# EAGLE design Arduino_2313_ref_a (EAGLE 6.2)
ATMEL 2313 USB interface uses FT232
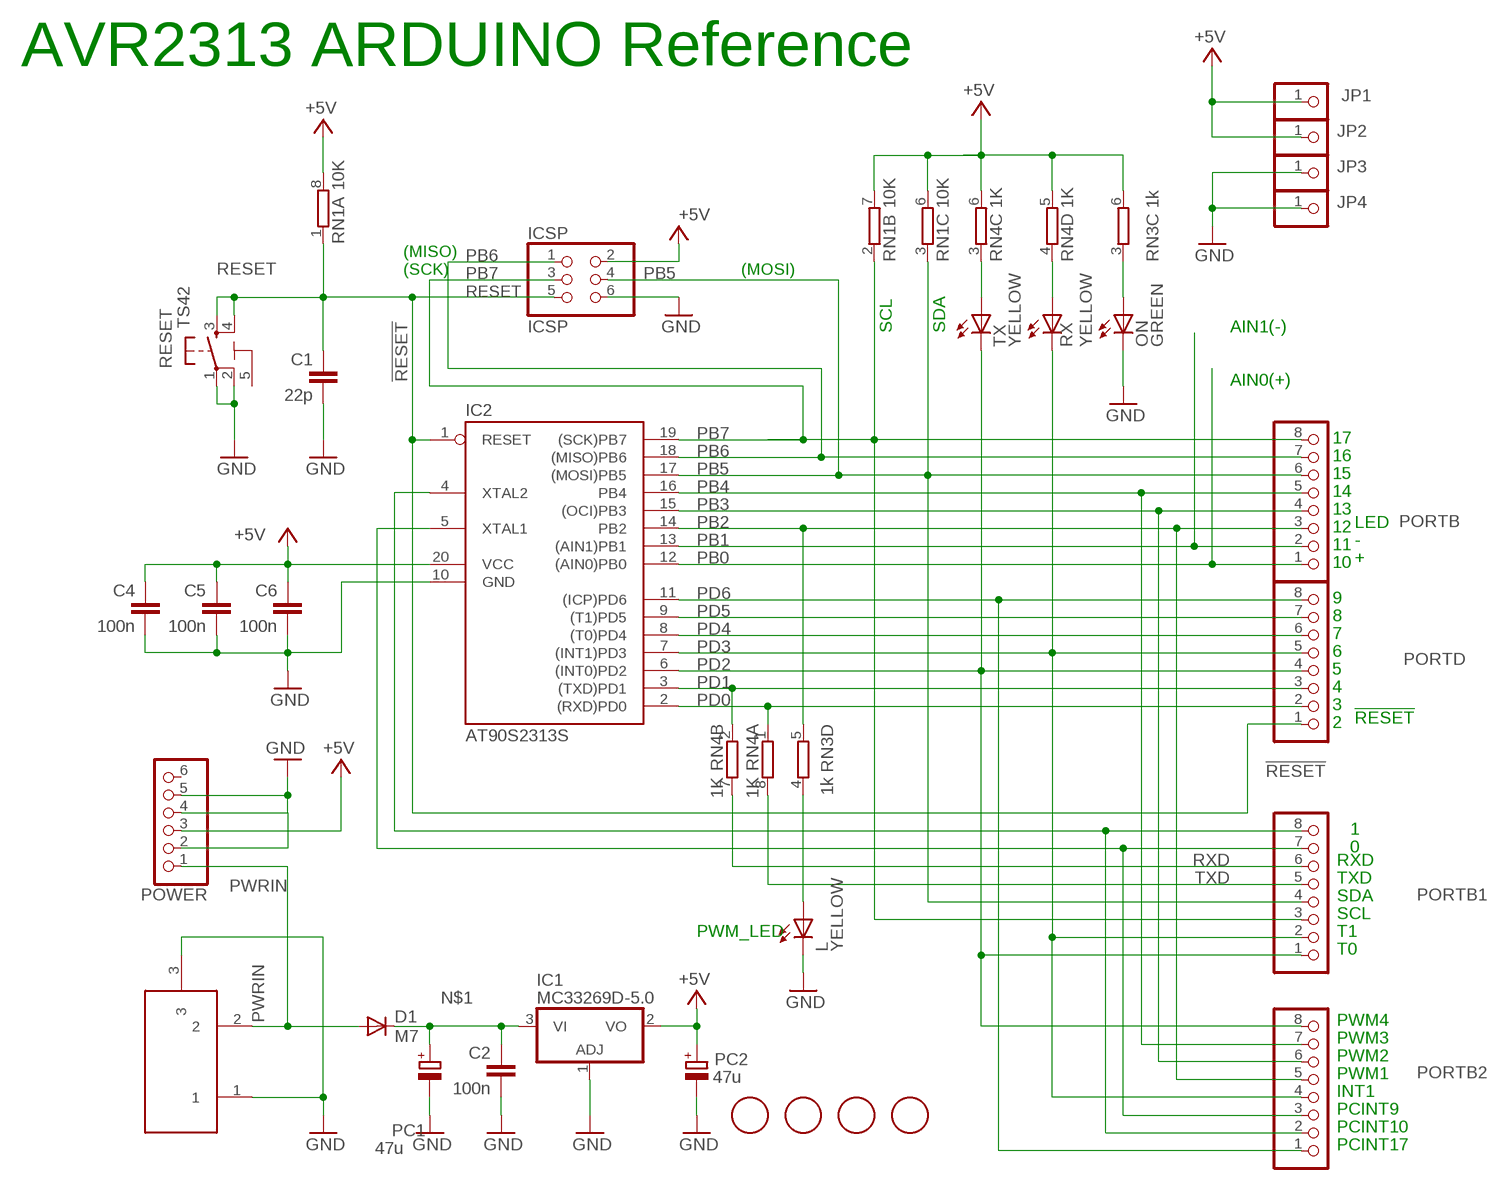
[diagram p0: schematic, sheet 1]

## Parts
C1  22p  C-EU0603-RND  [C0603-ROUND]
C2  100n  C-EU0603-RND  [C0603-ROUND]
C4  100n  C-EU0603-RND  [C0603-ROUND]
C5  100n  C-EU0603-RND  [C0603-ROUND]
C6  100n  C-EU0603-RND  [C0603-ROUND]
D1  M7  DIODE-SMB  [SMB]
IC1  MC33269D-5.0  [DPACK]
IC2  AT90S2313S  [SO20L]
ICSP  ICSP  PINHD-2X3  [2X03]
JP1  PINHD-1X1  [1X01]
JP2  PINHD-1X1  [1X01]
JP3  PINHD-1X1  [1X01]
JP4  PINHD-1X1  [1X01]
L  YELLOW  LEDCHIP-LED0805  [CHIP-LED0805]
ON  GREEN  LEDCHIP-LED0805  [CHIP-LED0805]
PC1  47u  CPOL-EUD  [PANASONIC_D]
PC2  47u  CPOL-EUD  [PANASONIC_D]
PORTB  PINHD-1X8  [1X08]
PORTB1  PINHD-1X8  [1X08]
PORTB2  PINHD-1X8  [1X08]
PORTD  PINHD-1X8  [1X08]
POWER  PINHD-1X6  [1X06]
RESET  TS42  [TS42]
RN1  10K  4R-NCAT16  [CAT16]
RN3  1k  4R-NCAY16  [CAY16]
RN4  1K  4R-NCAY16  [CAY16]
RX  YELLOW  LEDCHIP-LED0805  [CHIP-LED0805]
TX  YELLOW  LEDCHIP-LED0805  [CHIP-LED0805]
U$2  FIDUCIALMOUNT  [FIDUCIA-MOUNT]
U$3  FIDUCIALMOUNT  [FIDUCIA-MOUNT]
U$4  FIDUCIALMOUNT  [FIDUCIA-MOUNT]
U$5  FIDUCIALMOUNT  [FIDUCIA-MOUNT]
X1  DC21MMX  [DC-21MM]

## Nets
!RESET: IC2.1(RESET) ICSP.5 PORTD.1
+5V: C4.1 C5.1 C6.1 IC1.2(VO) IC2.20(VCC) ICSP.2 JP1.1 JP2.1 PC2.+ POWER.3 RN1.6 RN1.7 RN1.8 RN3.6 RN4.5 RN4.6
GND: C1.2 C2.2 C4.2 C5.2 C6.2 IC1.1(ADJ) IC2.10(GND) ICSP.6 JP3.1 JP4.1 L.C ON.C PC1.- PC2.- POWER.2 POWER.4 POWER.5 RESET.1 RESET.2 X1.1 X1.3
N$1: C2.1 D1.C IC1.3(VI) PC1.+
N$2: L.A RN3.4
N$3: ON.A RN3.3
N$54: RN4.4 RX.A
N$55: RN4.3 TX.A
PA0: IC2.5(XTAL1) PORTB1.7 PORTB2.3
PA1: IC2.4(XTAL2) PORTB1.8 PORTB2.2
PB0: IC2.12((AIN0)PB0) PORTB.1
PB1: IC2.13((AIN1)PB1) PORTB.2
PB2: IC2.14(PB2) PORTB2.5 PORTB.3 RN3.5
PB3: IC2.15((OCI)PB3) PORTB2.6 PORTB.4
PB4: IC2.16(PB4) PORTB2.7 PORTB.5
PB5: IC2.17((MOSI)PB5) ICSP.4 PORTB1.4 PORTB.6 RN1.3
PB6: IC2.18((MISO)PB6) ICSP.1 PORTB.7
PB7: IC2.19((SCK)PB7) ICSP.3 PORTB1.3 PORTB.8 RN1.2
PD0: IC2.2((RXD)PD0) PORTD.2 RN4.1
PD1: IC2.3((TXD)PD1) PORTD.3 RN4.2
PD2: IC2.6((INT0)PD2) PORTB1.1 PORTB2.8 PORTD.4 TX.C
PD3: IC2.7((INT1)PD3) PORTB1.2 PORTB2.4 PORTD.5 RX.C
PD4: IC2.8((T0)PD4) PORTD.6
PD5: IC2.9((T1)PD5) PORTD.7
PD6: IC2.11((ICP)PD6) PORTB2.1 PORTD.8
PWRIN: D1.A POWER.1 X1.2
RESET: C1.1 RESET.3 RESET.4 RN1.1
RXD: PORTB1.6 RN4.7
TXD: PORTB1.5 RN4.8
Unconnected: POWER.6 RN1.4 RN1.5 RN3.1 RN3.2 RN3.7 RN3.8

## Notes on the sheet
- AVR2313 ARDUINO Reference
- (MISO)
- (SCK) | (MOSI)
- SCL | SDA | AIN1(-)
- AIN0(+)
- 17
- 16
- 15
- 14
- 13
- 12 | LED
- 11 | -
- 10 | +
- 9
- 8
- 7
- 6
- 5
- 4
- 3
- 2 | !RESET
- 1
- 0
- RXD
- TXD
- SDA
- SCL
- PWM_LED | T1
- T0
- PWM4
- PWM3
- PWM2
- PWM1
- INT1
- PCINT9
- PCINT10
- PCINT17

## Power pins joined to a net without a drawn wire
5-GND: RESET.5(5-GND)

## Library data of the parts
C1 C2 C4-C6 = SmartPrj:C-EU: CAPACITOR, European symbol
D1 = diode:DIODE-: DIODE
IC1 = linear:MC33269?*: Adjustable Output Low Dropout Voltage Regulator 800 mA Source: http://www.onsemi.com/pub/Collateral/MC33269-D.PDF
IC2 = atmel:AT90S2313: MICROCONTROLLER 2 Kbytes FLASH 128 bytes SRAM 128 bytes EEPROM UART; OC_FARNELL: unknown; OC_NEWARK: unknown
ICSP = pinhead:PINHD-2X3: PIN HEADER
JP1-JP4 = pinhead:PINHD-1X1: PIN HEADER
L ON RX TX = led:LED: LED OSRAM: - CHIPLED LG R971, LG N971, LY N971, LG Q971, LY Q971, LO R971, LY R971 LH N974, LH R974 LS Q976, LO Q976, LY Q976 LO Q996 - Hyper CHIPLED LW Q18S LB Q993, LB Q99A, LB R99A - SideLED LS A670, LO A670, LY A670, LG A670, LP A670 LB A673, LV A673, LT A673, LW A673 LH A674 LY A675 LS A676, LA A676, LO A676, LY A676, LW A676 LS A679, LY A679, LG A679 - Hyper Micro SIDELED® LS Y876, LA Y876, LO Y876, LY Y876 LT Y87S - SmartLED LW L88C, LW L88S LB L89C, LB L89S, LG L890 LS L89K, LO L89K, LY L89K LS L896, LA L896, LO L896, LY L896 - TOPLED LS T670, LO T670, LY T670, LG T670, LP T670 LSG T670, LSP T670, LSY T670, LOP T670, LYG T670 LG T671, LOG T671, LSG T671 LB T673, LV T673, LT T673, LW T673 LH T674 LS T676, LA T676, LO T676, LY T676, LB T676, LH T676, LSB T676, LW T676 LB T67C, LV T67C, LT T67C, LS T67K, LO T67K, LY T67K, LW E67C LS E67B, LA E67B, LO E67B, LY E67B, LB E67C, LV E67C, LT E67C LW T67C LS T679, LY T679, LG T679 LS T770, LO T770, LY T770, LG T770, LP T770 LB T773, LV T773, LT T773, LW T773 LH T774 LS E675, LA E675, LY E675, LS T675 LS T776, LA T776, LO T776, LY T776, LB T776 LHGB T686 LT T68C, LB T68C - Hyper Mini TOPLED® LB M676 - Mini TOPLED Santana® LG M470 LS M47K, LO M47K, LY M47K Source: http://www.osram.convergy.de LUXEON: - LUMILED® LXK2-PW12-R00, LXK2-PW12-S00, LXK2-PW14-U00, LXK2-PW14-V00 LXK2-PM12-R00, LXK2-PM12-S00, LXK2-PM14-U00 LXK2-PE12-Q00, LXK2-PE12-R00, LXK2-PE12-S00, LXK2-PE14-T00, LXK2-PE14-U00 LXK2-PB12-K00, LXK2-PB12-L00, LXK2-PB12-M00, LXK2-PB14-N00, LXK2-PB14-P00, LXK2-PB14-Q00 LXK2-PR12-L00, LXK2-PR12-M00, LXK2-PR14-Q00, LXK2-PR14-R00 LXK2-PD12-Q00, LXK2-PD12-R00, LXK2-PD12-S00 LXK2-PH12-R00, LXK2-PH12-S00 LXK2-PL12-P00, LXK2-PL12-Q00, LXK2-PL12-R00 Source: www.luxeon.com KINGBRIGHT: KA-3528ASYC Source: www.kingbright.com
PC1 PC2 = rcl:CPOL-EU: POLARIZED CAPACITOR, European symbol
PORTB PORTB1 PORTB2 PORTD = pinhead:PINHD-1X8: PIN HEADER
POWER = pinhead:PINHD-1X6: PIN HEADER
RESET = st-mod v1.4:TS42: TS42 Dongnan Electronics Tact switch VDC 12V - 50mA
RN1 RN3 RN4 = resistor-dil:4R-N: Array Chip Resistor Source: RS Component / Phycomp; OC_FARNELL: unknown; OC_NEWARK: unknown
U$2-U$5 = SmartPrj:FIDUCIALMOUNT
X1 = powersupply:DC21MM

## Net classes
0 default: width 0.152 mm, drill 0.305 mm, clearance 0.152 mm

## Board
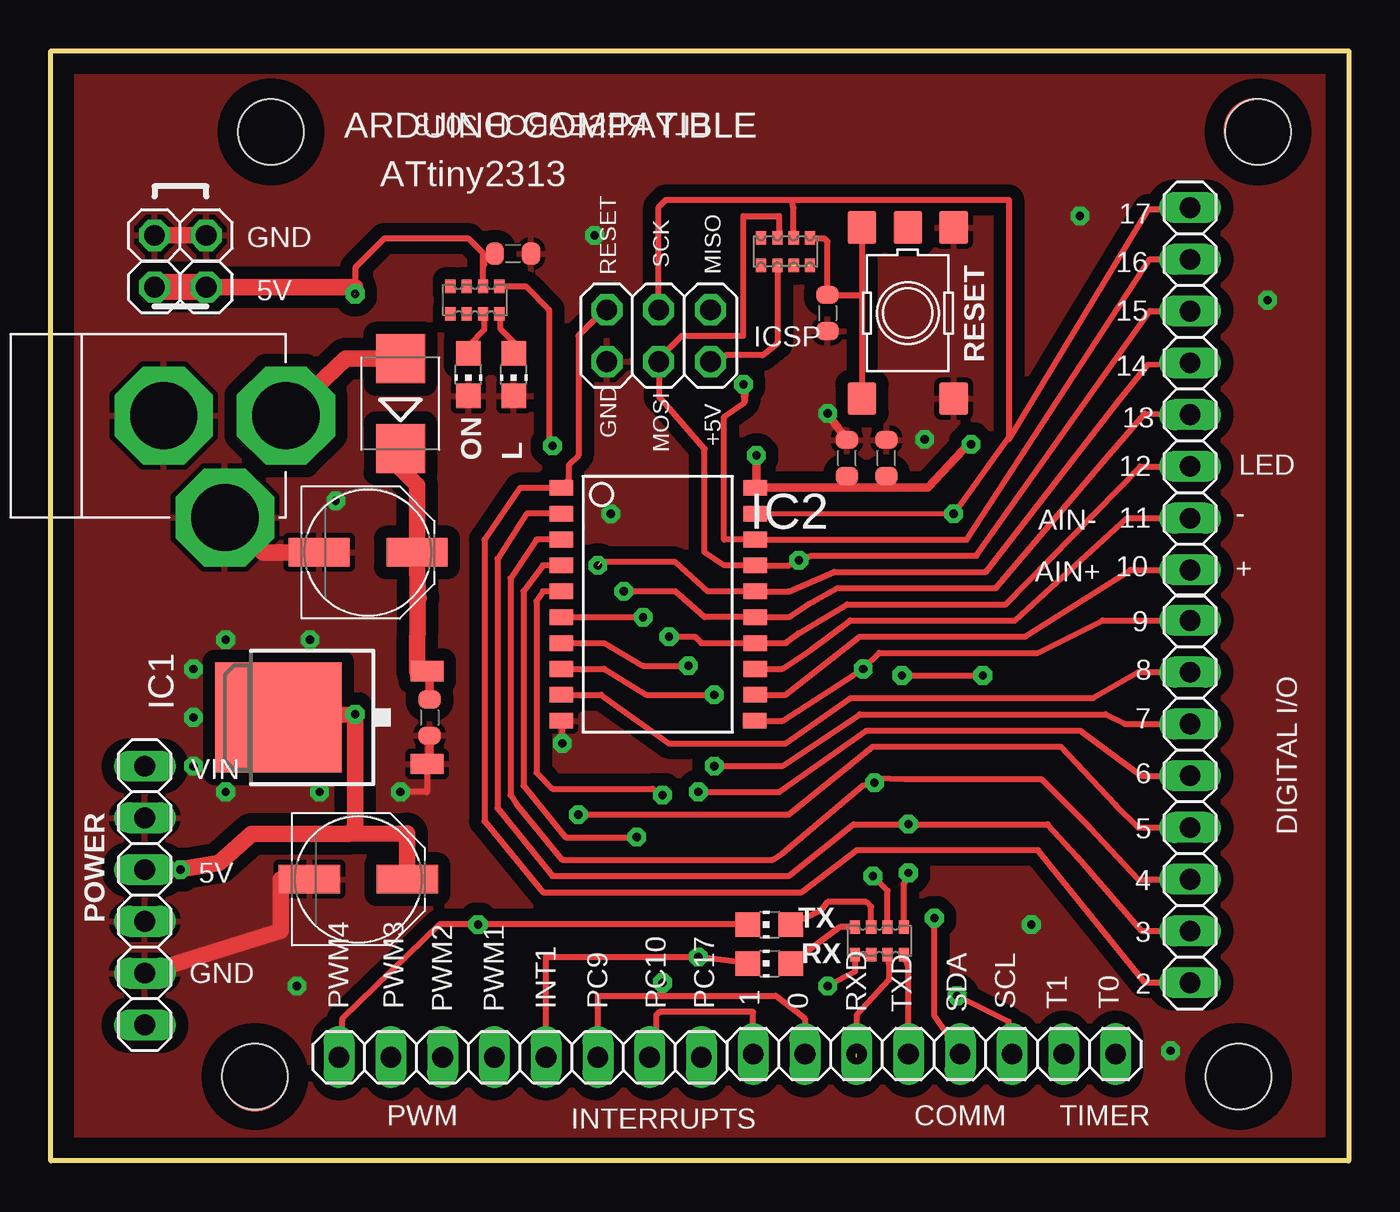
[diagram p1: board, top side]
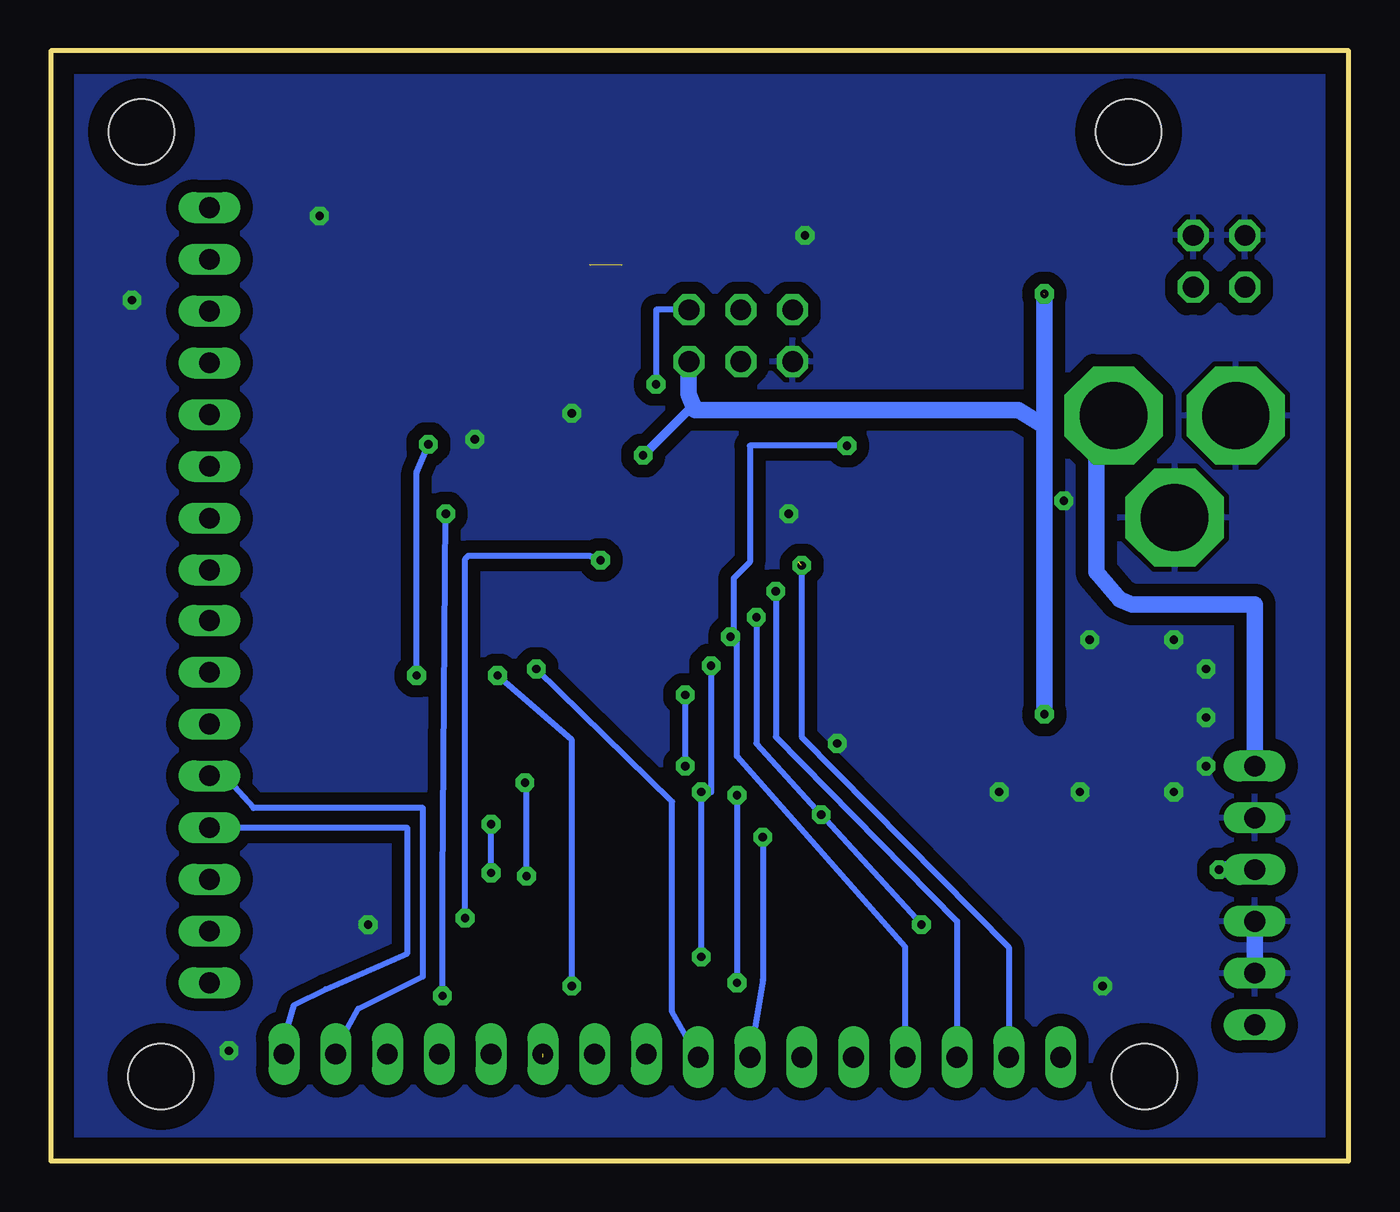
[diagram p2: board, bottom side, seen from below]

Size 63.66 x 54.45 mm. Coordinates in mm from the lower left corner, seen from the top.
Outline: 0,54.45 63.66,54.45 63.66,0 0,0 0,54.45
Copper layers (1*16): Top 0.035mm / dielectric 1.5mm / Bottom 0.035mm
Design rules: minimum track width 6mil, minimum drill 12mil, track to track 6mil, track to pad 6mil, pad to pad 6mil, via to via 6mil, smd to smd 6mil, copper to edge 40mil, drill to drill 12mil, minimum pad ring 10mil, minimum via ring 10mil, stop-mask expansion 2mil, vias tented up to drill 1mil, thermal gap 10mil
Holes 3.2 mm at 58.26,4.13 10.79,50.48 10,4.13 59.21,50.48

### Footprints (pad centres in the part's own frame; a part is rotated, then mirrored left to right if it is on the bottom)
C0603-ROUND = smd 0.898 x 1.1: 1 -0.889,0; 2 0.889,0
SMB = smd 2.4 x 2.4: A 2.2,0; C -2.2,0
DPACK = smd 1 x 1.6: 1 -2.28,-4.8; 3 2.28,-4.8 | smd 5.4 x 6.2: 2 0,2.5
SO20L = smd 0.762 x 1.143: 1 -5.08,-5.131; 2 -3.81,-5.131; 3 -2.54,-5.131; 4 -1.27,-5.131; 5 0,-5.131; 6 1.27,-5.131; 7 2.54,-5.131; 8 3.81,-5.131; 9 5.08,-5.131; 10 6.35,-5.131; 11 6.35,4.369; 12 5.08,4.394; 13 3.81,4.394; 14 2.54,4.394; 15 1.27,4.394; 16 0,4.394; 17 -1.27,4.394; 18 -2.54,4.394; 19 -3.81,4.394; 20 -5.08,4.394
2X03 = drill 1.016 octagon: 1 -2.54,-1.27; 2 -2.54,1.27; 3 0,-1.27; 4 0,1.27; 5 2.54,-1.27; 6 2.54,1.27
1X01 = drill 1.016 octagon: 1 0,0
CHIP-LED0805 = smd 1.2 x 1.2: A 0,-1.05; C 0,1.05
PANASONIC_D = smd 3 x 1.4: + 2.4,0; - -2.4,0
1X08 = drill 1.016 long: 1 -8.89,0; 2 -6.35,0; 3 -3.81,0; 4 -1.27,0; 5 1.27,0; 6 3.81,0; 7 6.35,0; 8 8.89,0
1X06 = drill 1.016 long: 1 -6.35,0; 2 -3.81,0; 3 -1.27,0; 4 1.27,0; 5 3.81,0; 6 6.35,0
TS42 = smd 1.6 x 1.4: 1 -4.2,2.25; 2 4.2,2.25; 3 -4.2,-2.25; 4 4.2,-2.25; 5 -4.2,0
CAT16 = smd 0.5 x 0.65: 1 -1.2,-0.675; 2 -0.4,-0.675; 3 0.4,-0.675; 4 1.2,-0.675; 5 1.2,0.675; 6 0.4,0.675; 7 -0.4,0.675; 8 -1.2,0.675
CAY16 = smd 0.5 x 0.65: 1 -1.2,-0.675; 2 -0.4,-0.675; 3 0.4,-0.675; 4 1.2,-0.675; 5 1.2,0.675; 6 0.4,0.675; 7 -0.4,0.675; 8 -1.2,0.675
FIDUCIA-MOUNT = smd 1.016 x 1.016: P$1 0,0
DC-21MM = drill 3.302 pad 4.826 octagon: 1 -5.08,-3.353; 2 -0.076,-6.35; 3 -0.076,-0.356

### Placement (x,y rotation side)
C1  38.1,41.59 270 top
C2  18.57,21.75 270 top
C4  40.99,34.48 90 top
C5  39.05,34.48 90 top
C6  22.66,44.51 0 top
D1  17.14,37.15 90 top
IC1  13.65,21.75 90 top
IC2  30.16,27.94 270 top
ICSP  29.81,40.48 180 top
JP1  7.62,42.86 180 top
JP2  5.08,42.86 180 top
JP3  7.62,45.4 180 top
JP4  5.08,45.4 180 top
L  22.7,38.58 180 top
ON  20.48,38.58 180 top
PC1  15.56,29.84 0 top
PC2  15.08,13.81 0 top
PORTB  55.88,37.88 90 top
PORTB1  43.34,5.24 180 top
PORTB2  23.02,5.08 180 top
PORTD  55.88,17.62 90 top
POWER  4.6,13.02 270 top
RESET  42.04,41.59 270 top
RN1  36.04,44.61 180 top
RN3  20.8,42.23 0 top
RN4  40.64,10.79 180 top
RX  35.24,9.68 90 top
TX  35.24,11.59 90 top
U$2  59.09,50.57 0 top
U$3  10.83,50.51 270 top
U$4  10,4 270 top
U$5  58.26,4.22 0 top
X1  5.18,36.64 90 top

### Tracks (layer width: path | path; a pad name or v marks a point on that pad's centre or on a via)
!RESET
  Top 0.305: PORTD.1 53.66,8.73 48.42,15.24 39.53,15.24 36.83,13.18 24.13,13.18 21.27,16.67 21.27,30.48 23.02,33.02 IC2.1 25.4,33.39 25.4,34.13 25.88,34.61 25.88,40.48 27.15,41.75 ICSP.5
+5V  (via drill 0.41, 0.41 pad 0.25)  (3 unrouted)
  Top 0.254: RN4.6 RN4.5
  Top 0.305: RN4.5 39.44,9.28 v38.1,8.57 | v41.75,23.81 v45.72,23.81 | v45.14,35.15 44.98,34.95 44.75,34.88 | RN1.6 35.64,40.08 34.93,39.53 33.15,39.53 ICSP.2 | C6.1 21.24,44.13 21.27,43.97 21.2,43.9 RN3.6 21.2,44.53 20.48,45.24 16.35,45.24 14.92,43.81 v14.92,42.55
  Top 0.406: 38.42,33.02 IC2.20 34.61,33.07 v34.61,34.61 | 38.42,33.02 39.05,33.02 | 39.05,33.02 43.02,33.02 44.75,34.88 44.93,35.08 v45.14,35.15 | C4.1 40.83,33.05 38.42,33.02 | C5.1 39.05,33.02
  Top 0.813: PC2.+ 17.48,16.05 14.61,16.05 | 14.61,16.05 9.84,16.03 8.26,14.61 v6.35,14.29 | IC1.2 v14.92,21.91 14.92,16.36 14.61,16.05 | JP1.1 14.92,42.86 v14.92,42.55
  Top 1.27: JP1.1 JP2.1
  Bottom 0.305: 32.39,39.4 ICSP.2 | v38.1,8.57 38.1,20.64 v41.75,23.81 | v45.72,23.81 45.72,33.78 v45.14,35.15
  Bottom 0.406: 32.07,36.83 32.39,36.83 v34.61,34.61
  Bottom 0.813: v14.92,21.91 14.92,36.04 | 14.92,36.04 16.19,36.83 32.07,36.83 32.39,37.62 32.39,39.18 ICSP.2 | v14.92,42.55 14.92,36.04 | v6.35,14.29 POWER.3
  other vias: 14.92,42.52
GND  (via drill 0.41 pad 0.25)
  Top 0.305: IC2.10 25.08,21.59 v25.08,20.48 | IC1.1 18.45,18.1 v17.15,18.1
  Top 0.406: C5.2 v38.1,36.67 | C2.2 18.57,19.59 IC1.1
  Top 0.813: JP3.1 JP4.1 | PC2.- 11.27,13.81 11.27,11.27 POWER.5 | PC1.- 10.4,29.84 X1.1
  Bottom 0.305: 13.02,18.1 v13.18,18.1
  Bottom 0.813: POWER.5 POWER.4
  other vias: 42.86,35.4 8.57,18.1 6.98,19.37 6.98,21.75 6.98,24.13 8.57,25.56 12.7,25.56 12.7,25.56 27.46,31.75 13.97,32.38 50.48,46.35 59.69,42.23 48.1,11.59 54.93,5.4 12.06,8.57 26.67,45.4
  pour Bottom (isolate 0.61): 0.16,54.29 63.18,54.29 63.34,0.16 0.16,0.16
  pour Top (isolate 0.61): 0.16,54.45 63.34,54.45 63.34,0.16 0.32,0.32
N$1
  Top 0.305: IC1.3 18.52,24.03 18.57,23.97 18,23.97 17.96,24.01
  Top 0.406: C2.1 18.57,23.91 IC1.3
  Top 0.813: 17.96,24.01 17.98,27.57 | 17.98,27.57 PC1.+ 17.96,33.16 17.15,33.97 D1.C | 18.03,27.62 17.98,27.57
N$2
  Top 0.305: L.A 22.7,40.16 22.07,40.8 22.07,41.48 RN3.4
N$3
  Top 0.305: ON.A 20.48,40.01 21.27,40.8 21.27,41.48 RN3.3
N$54
  Top 0.305: RN4.4 38.71,11.47 RX.A
N$55
  Top 0.305: RN4.3 40.24,12.46 40.01,12.7 38.1,12.7 37.78,12.29 TX.A
PA0  (via drill 0.41)
  Top 0.305: IC2.5 24.13,27.94 23.81,27.46 23.81,19.05 24.61,18.26 29.53,18.26 v30,17.94 | PORTB2.3 26.83,8.1 29.69,8.1 | 29.69,8.1 35.56,8.1 36.99,6.99 PORTB1.7 | v30,8.73 30,8.26 29.69,8.1
  Bottom 0.305: v30,17.94 v30,8.73
PA1  (via drill 0.41)
  Top 0.254: IC2.4 24.97,29.15
  Top 0.305: 24.97,29.15 24.97,29.17 24.92,29.21 24.13,29.21 23.18,27.94 23.18,18.41 25.24,15.88 v28.73,15.88 | PORTB1.8 34.45,7.3 29.85,7.3 29.69,7.14 29.69,5.56 PORTB2.2
  Bottom 0.305: v28.73,15.88 28.73,8.89 PORTB2.2
PB0
  Top 0.254: IC2.12 35.08,22.86
  Top 0.305: 35.08,22.86 36.04,22.86 39.69,25.72 47.78,25.72 52.96,28.99 PORTB.1
PB1
  Top 0.305: IC2.13 35.88,24.13 37.31,25.08 39.21,26.51 47.31,26.51 52.8,31.53 PORTB.2
PB2  (via drill 0.41)
  Top 0.305: PORTB.3 53.44,34.07 46.83,27.3 39.05,27.3 36.67,25.88 36.04,25.4 IC2.14 31.91,25.4 31.59,25.72 v30.32,25.72 | RN3.5 23.3,42.9 24.45,41.75 24.45,35.24 v24.61,35.08
  Bottom 0.305: PORTB2.5 21.75,10.48 30,19.84 30,25.88 v30.32,25.72 30.16,25.88 30.16,28.57 29.37,29.37 29.37,35.08 v24.61,35.08
PB3  (via drill 0.41)
  Top 0.305: PORTB.4 53.66,36.67 51.75,34.45 46.36,28.1 38.58,28.1 37.15,27.3 36.2,26.67 IC2.15 32.07,26.67 30.64,27.94 v28.1,27.94
  Bottom 0.305: v28.1,27.94 28.1,20.8 19.21,11.75 PORTB2.6
PB4  (via drill 0.41)  (1 unrouted)
  Top 0.305: PORTB.5 53.82,39.05 52.39,37.31 45.88,28.89 38.42,28.89 36.2,27.94 IC2.16 32.23,27.94 30.64,29.37 26.99,29.37
  Bottom 0.305: v26.83,29.21 26.83,20.8 16.67,10.48 PORTB2.7
PB5  (via drill 0.41)
  Top 0.305: 36.75,29.45 36.2,29.21 IC2.17 33.02,29.21 32.07,29.84 32.07,34.92 29.85,37.47 29.85,38.23 ICSP.4 29.81,39.34 30.96,40.48 33.97,40.48 33.97,46.35 35.72,46.35 35.72,45.37 RN1.3 | 36.75,29.45 v36.7,29.47 | v36.7,29.47 37.31,29.69 45.4,29.69 53.91,41.69 PORTB.6 | PORTB1.4 43.34,7.14 v43.34,11.91 | v36.7,29.47 36.46,29.47 36.75,29.45
  Bottom 0.305: v43.34,11.91 43.34,29.53 43.18,29.69 37.23,29.69 v36.7,29.47
PB6  (via drill 0.41)
  Top 0.305: PORTB.7 53.91,44.23 44.93,30.48 IC2.18 33.02,30.48 33.02,36.51 34.02,37.2 | 34.02,37.2 v33.97,38.1 34.12,38.1 34.02,37.2
  Bottom 0.305: ICSP.1 33.97,41.75 v33.97,38.1
PB7  (via drill 0.41, 0.41 pad 0.25)
  Top 0.254: IC2.19 v44.29,31.75
  Top 0.305: PORTB1.3 46.99,6.83 v44.45,8.1 | ICSP.3 29.81,46.8 30.16,47.15 36.35,47.15 | 36.35,47.15 46.99,47.15 46.99,35.4 | 46.99,35.4 47.15,35.72 v44.29,31.75 | PORTB.8 55.72,46.67 53.82,46.67 46.99,35.4 | RN1.2 36.44,46.75 36.35,47.15
  Bottom 0.305: v44.45,8.1 44.45,13.65 v44.29,31.75
PD0  (via drill 0.41)
  Top 0.305: IC2.2 23.34,31.75 21.91,29.53 21.91,17.3 24.61,13.97 36.2,13.97 39.37,16.51 v42.07,16.51 48.9,16.51 50.32,14.92 53.5,11.27 PORTD.2 | RN4.1 41.84,13.56 v42.07,14.13
  Bottom 0.305: v42.07,14.13 v42.07,16.51
PD1  (via drill 0.41)
  Top 0.305: IC2.3 23.81,30.48 22.54,28.57 22.54,17.94 22.86,17.46 25.08,14.76 35.4,14.76 35.88,15.08 39.85,18.41 v40.4,18.55 | v40.4,18.55 40.39,18.78 | 40.39,18.78 41.91,18.73 48.58,18.73 50.96,16.35 53.34,13.81 PORTD.3 | RN4.2 41.04,13.25 v40.32,13.97 | v40.4,18.55 40.48,18.55 40.39,18.78
  Bottom 0.305: v40.32,13.97 40.32,18.79 v40.4,18.55
PD2  (via drill 0.41, 0.41 pad 0.25)
  Top 0.305: IC2.6 v29.05,26.67 | v25.88,16.99 36.2,16.99 40.32,20.32 49.53,20.32 52.23,17.46 53.34,16.35 PORTD.4 | TX.C v20.96,11.59 19.05,11.59 14.29,6.99 PORTB2.8
  Bottom 0.305: v29.05,26.67 29.05,20.48 v25.88,16.99 v20.96,11.59 | PORTD.4 46.2,16.35 46.2,10.16 50.17,8.41 51.75,7.62 52.23,6.03 PORTB1.1
PD3  (via drill 0.41)
  Top 0.305: IC2.7 27.15,25.4 29.05,24.29 v31.27,24.29 | v31.75,18.1 35.72,18.1 40.01,21.11 50.48,21.11 53.5,18.89 PORTD.5 | RX.C v31.75,10 24.29,10 PORTB2.4
  Bottom 0.305: v31.27,24.29 31.27,18.1 v31.75,18.1 v31.75,10 | PORTB1.2 49.53,5.24 49.37,6.03 48.58,7.46 45.4,9.05 45.4,17.3 53.73,17.3 54.91,18.64 56.43,18.64 PORTD.5
PD4  (via drill 0.41 pad 0.25)
  Top 0.305: IC2.8 27.15,24.13 29.21,22.86 v32.54,22.86 | v32.54,19.37 35.88,19.37 39.69,21.91 51.75,21.91 52.71,21.43 PORTD.6
  Bottom 0.305: v32.54,22.86 v32.54,19.37
PD5
  Top 0.305: IC2.9 26.99,22.86 30.32,20.48 36.04,20.48 39.21,22.7 51.12,22.7 53.34,23.97 PORTD.7
PD6  (via drill 0.41)
  Top 0.305: IC2.11 35.88,21.59 v39.85,24.13 40.64,24.92 48.42,24.92 51.59,26.51 PORTD.8
  Bottom 0.305: PORTB2.1 33.18,7.3 33.18,17.62 v39.85,24.13
PWRIN
  Top 0.813: D1.A 14.47,39.35 X1.2
  Bottom 0.813: POWER.1 4.6,27.3 10.64,27.3 11.21,27.53 12.38,28.89 12.38,36.56 X1.2
RESET
  Top 0.305: RESET.3 39.79,42.55 | 39.79,42.55 RESET.4 | 39.79,42.55 39.72,42.48 C1.1 38.1,45.09 37.94,45.24 37.28,45.24 RN1.1
RXD  (1 unrouted)
  Top 0.305: RN4.7 41.04,10.24 41.12,9.53 41.12,8.89 39.53,7.14 39.53,5.08
TXD
  Top 0.305: PORTB1.5 42.07,9.57 RN4.8

### Text on the board
tNames: ARDUINO COMPATIBLE | ELY RESEARCH 2013 | ATtiny2313 | 17 | GND | 16 | SCK | RESET | MISO | 5V | 15 | 14 | 13 | GND | MOSI | +5V | 12 | LED | 11 | AIN- | - | 10 | + | AIN+ | 9 | 8 | 7 | 6 | VIN | 5 | DIGITAL I/O | 5V | 4 | 3 | GND | 2 | 1 | PWM4 | PWM3 | PWM2 | PWM1 | INT1 | PC9 | PC10 | PC17 | 0 | RXD | TXD | SDA | SCL | T1 | T0 | PWM | INTERRUPTS | COMM | TIMER
ReferenceLC: L | TX | RX | PC1 | PC2